# EAGLE design eagle (EAGLE 9.6.2)
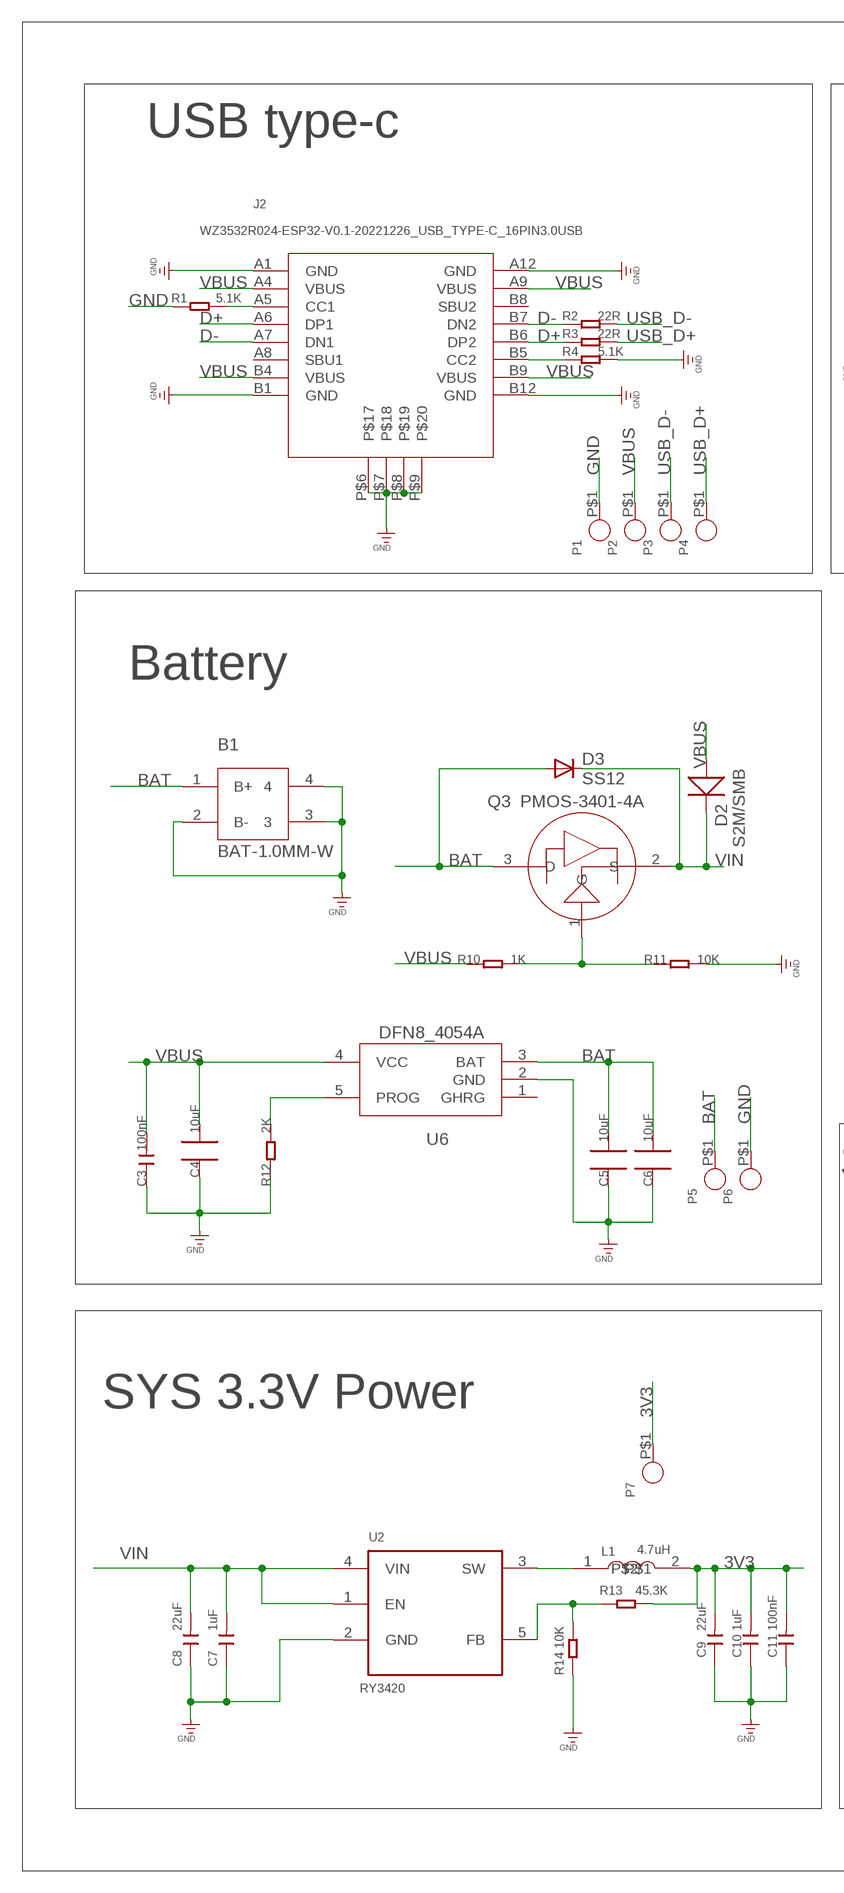
[diagram p0: schematic, sheet 1, part 1 of 2]
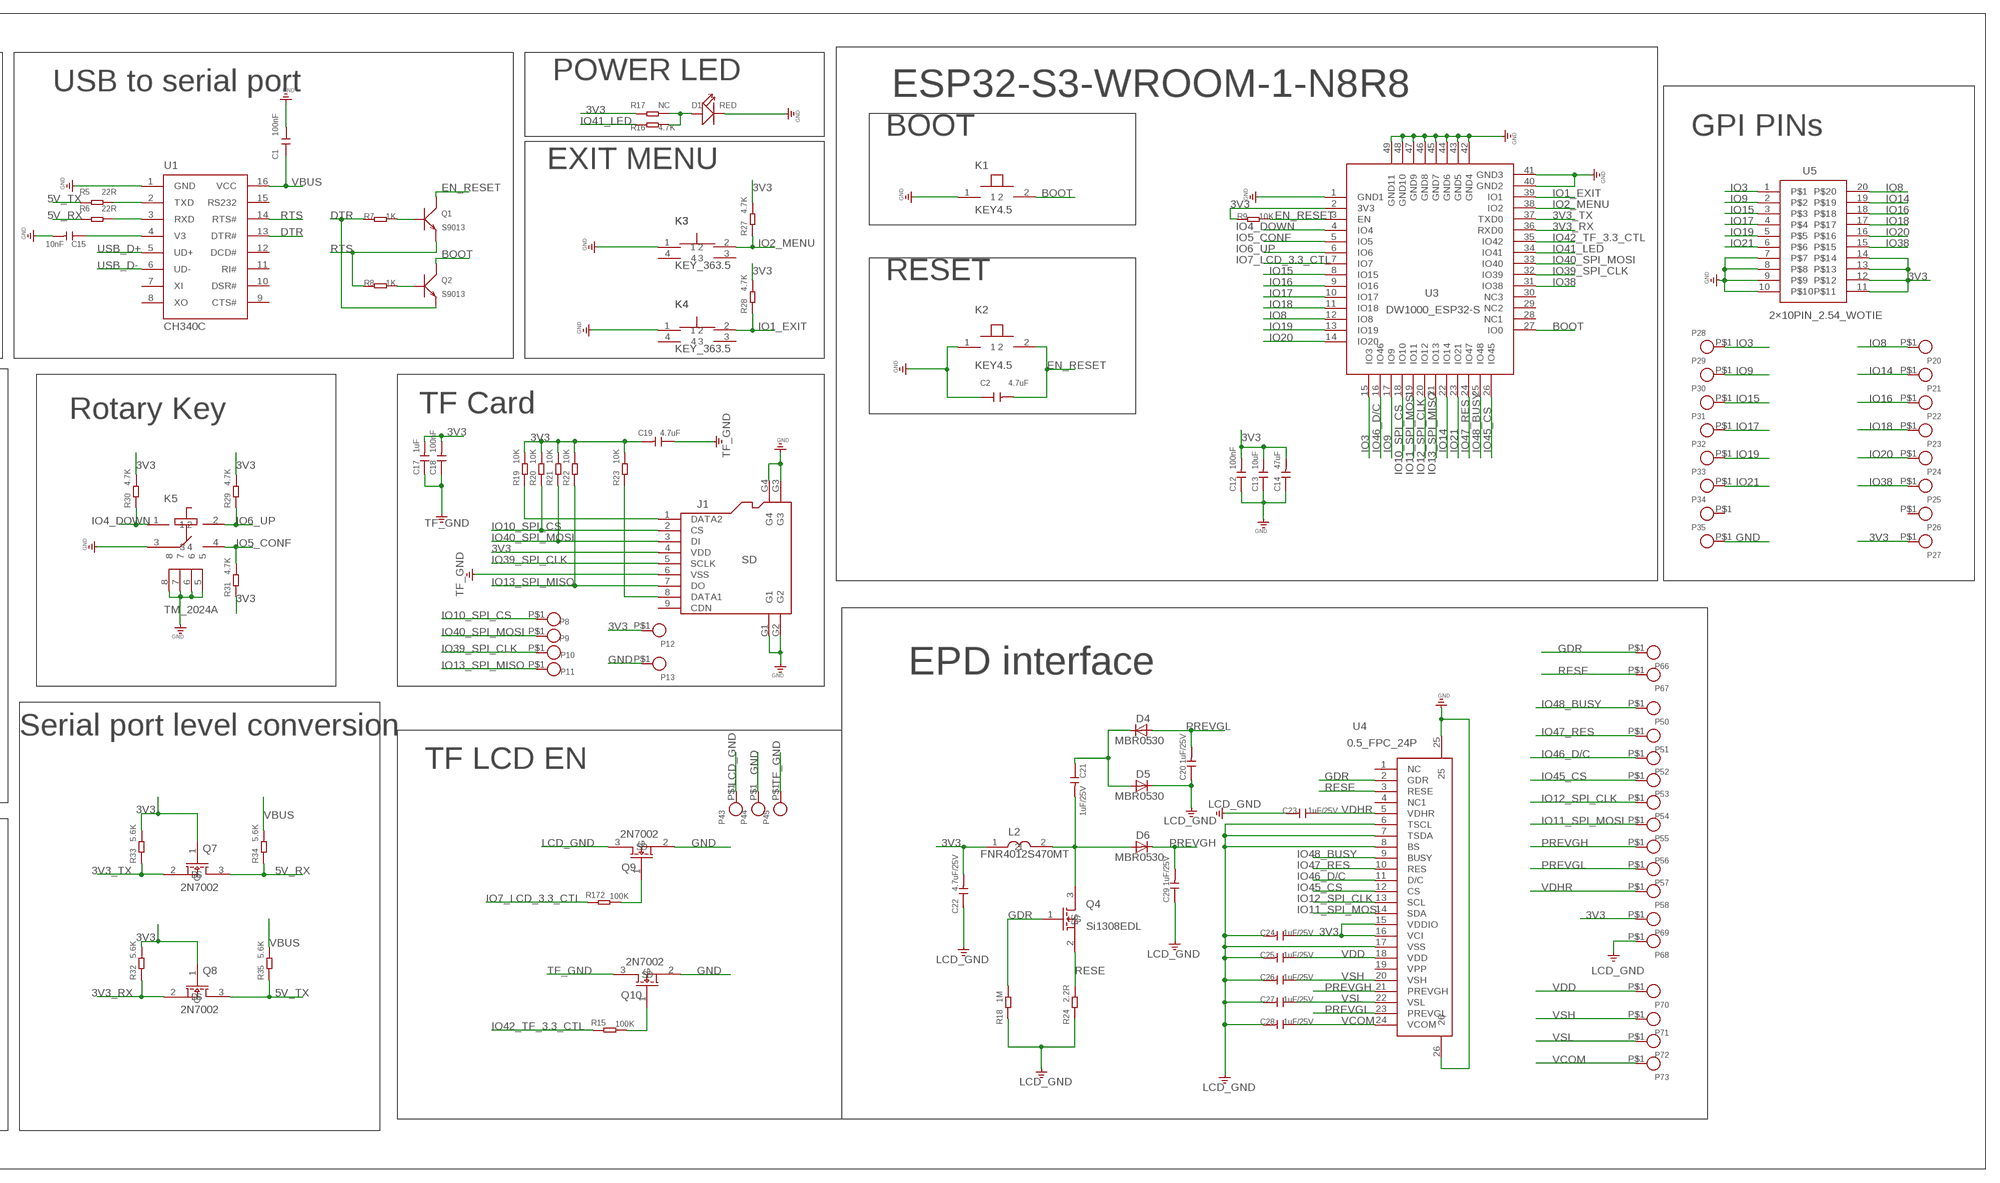
[diagram p1: schematic, sheet 1, part 2 of 2]

## Parts
B1  BAT-1.0MM-W  [SH1.0MM-W]
C1  100nF  C0603  [0603]
C2  4.7uF  A_XBJ_C0603  [A_XBJ_0603]
C3  100nF  A9G_DISCRETE_C-0603  [A9G_DISCRETE_C0603]
C4  10uF  CPT_SMD_C0805_S  [CPT_SMD_0805_S]
C5  10uF  CPT_SMD_C0805_S  [CPT_SMD_0805_S]
C6  10uF  CPT_SMD_C0805_S  [CPT_SMD_0805_S]
C7  1uF  A_XBJ_C0603  [A_XBJ_0603]
C8  22uF  A_XBJ_C0805  [A_XBJ_0805]
C9  22uF  A_XBJ_C0805  [A_XBJ_0805]
C10  1uF  A_XBJ_C0603  [A_XBJ_0603]
C11  100nF  A_XBJ_C0603  [A_XBJ_0603]
C12  100nF  A9G_DISCRETE_C-0603  [A9G_DISCRETE_C0603]
C13  10uF  A9G_DISCRETE_C-0603  [A9G_DISCRETE_C0603]
C14  47uF  A9G_DISCRETE_C-0805  [A9G_DISCRETE_C0805]
C15  10nF  A_XBJ_C0603  [A_XBJ_0603]
C17  1uF  A9G_DISCRETE_C-0603  [A9G_DISCRETE_C0603]
C18  100nF  A9G_DISCRETE_C-0603  [A9G_DISCRETE_C0603]
C19  4.7uF  A9G_DISCRETE_C-0603  [A9G_DISCRETE_C0603]
C20  1uF/25V  A9G_DISCRETE_C-0603  [A9G_DISCRETE_C0603]
C21  1uF/25V  A9G_DISCRETE_C-0603  [A9G_DISCRETE_C0603]
C22  4.7uF/25V  A9G_DISCRETE_C-0603  [A9G_DISCRETE_C0603]
C23  1uF/25V  A9G_DISCRETE_C-0603  [A9G_DISCRETE_C0603]
C24  1uF/25V  A9G_DISCRETE_C-0603  [A9G_DISCRETE_C0603]
C25  1uF/25V  A9G_DISCRETE_C-0603  [A9G_DISCRETE_C0603]
C26  1uF/25V  A9G_DISCRETE_C-0603  [A9G_DISCRETE_C0603]
C27  1uF/25V  A9G_DISCRETE_C-0603  [A9G_DISCRETE_C0603]
C28  1uF/25V  A9G_DISCRETE_C-0603  [A9G_DISCRETE_C0603]
C29  1uF/25V  A9G_DISCRETE_C-0603  [A9G_DISCRETE_C0603]
D1  RED  A_XBJ_DISCRETE_LED0603  [A_XBJ_DISCRETE_LED-0603]
D2  S2M/SMB  DO-214AB_214ABDO-214AB  [DO-214AB_214AB]
D3  SS12  DIODE_DIODE-DO-214AC  [DIODE_DO-214AC]
D4  MBR0530  DIODE_DIODE-SOD123  [DIODE_SOD123]
D5  MBR0530  DIODE_DIODE-SOD123  [DIODE_SOD123]
D6  MBR0530  DIODE_DIODE-SOD123  [DIODE_SOD123]
J1  SD  CONNECTOR_HOLDER-MICROSD-9P  [CONNECTOR_9P-SMD-W/-RING]
J2  WZ3532R024-ESP32-V0.1-20221226_USB_TYPE-C_16PIN3.0USB  [WZ3532R024-ESP32-V0.1-20221226_KEVIN_3.0TYPEC-SMD]
K1  KEY4.5  [KEY-4.5]
K2  KEY4.5  [KEY-4.5]
K3  KEY_363.5  [KEY_3*6*3.5]
K4  KEY_363.5  [KEY_3*6*3.5]
K5  TM_2024A  [TM_2024A]
L1  4.7uH  WZ2432R028-ESP32-V1.2-20231108_L-0530  [WZ2432R028-ESP32-V1.2-20231108_CD54_CD54]
L2  FNR4012S470MT  [FNR4012S470MT]
P1  CROWPI_POW_PADPAD-1.0MM  [CROWPI_POW_PAD-1.0MM]
P2  CROWPI_POW_PADPAD-1.0MM  [CROWPI_POW_PAD-1.0MM]
P3  CROWPI_POW_PADPAD-1.0MM  [CROWPI_POW_PAD-1.0MM]
P4  CROWPI_POW_PADPAD-1.0MM  [CROWPI_POW_PAD-1.0MM]
P5  CROWPI_POW_PADPAD-1.0MM  [CROWPI_POW_PAD-1.0MM]
P6  CROWPI_POW_PADPAD-1.0MM  [CROWPI_POW_PAD-1.0MM]
P7  CROWPI_POW_PADPAD-1.0MM  [CROWPI_POW_PAD-1.0MM]
P8  CROWPI_POW_PADPAD-1.0MM  [CROWPI_POW_PAD-1.0MM]
P9  CROWPI_POW_PADPAD-1.0MM  [CROWPI_POW_PAD-1.0MM]
P10  CROWPI_POW_PADPAD-1.0MM  [CROWPI_POW_PAD-1.0MM]
P11  CROWPI_POW_PADPAD-1.0MM  [CROWPI_POW_PAD-1.0MM]
P12  CROWPI_POW_PADPAD-1.0MM  [CROWPI_POW_PAD-1.0MM]
P13  CROWPI_POW_PADPAD-1.0MM  [CROWPI_POW_PAD-1.0MM]
P20  CROWPI_POW_PADPAD-1.0MM  [CROWPI_POW_PAD-1.0MM]
P21  CROWPI_POW_PADPAD-1.0MM  [CROWPI_POW_PAD-1.0MM]
P22  CROWPI_POW_PADPAD-1.0MM  [CROWPI_POW_PAD-1.0MM]
P23  CROWPI_POW_PADPAD-1.0MM  [CROWPI_POW_PAD-1.0MM]
P24  CROWPI_POW_PADPAD-1.0MM  [CROWPI_POW_PAD-1.0MM]
P25  CROWPI_POW_PADPAD-1.0MM  [CROWPI_POW_PAD-1.0MM]
P26  CROWPI_POW_PADPAD-1.0MM  [CROWPI_POW_PAD-1.0MM]
P27  CROWPI_POW_PADPAD-1.0MM  [CROWPI_POW_PAD-1.0MM]
P28  CROWPI_POW_PADPAD-1.0MM  [CROWPI_POW_PAD-1.0MM]
P29  CROWPI_POW_PADPAD-1.0MM  [CROWPI_POW_PAD-1.0MM]
P30  CROWPI_POW_PADPAD-1.0MM  [CROWPI_POW_PAD-1.0MM]
P31  CROWPI_POW_PADPAD-1.0MM  [CROWPI_POW_PAD-1.0MM]
P32  CROWPI_POW_PADPAD-1.0MM  [CROWPI_POW_PAD-1.0MM]
P33  CROWPI_POW_PADPAD-1.0MM  [CROWPI_POW_PAD-1.0MM]
P34  CROWPI_POW_PADPAD-1.0MM  [CROWPI_POW_PAD-1.0MM]
P35  CROWPI_POW_PADPAD-1.0MM  [CROWPI_POW_PAD-1.0MM]
P43  CROWPI_POW_PADPAD-1.0MM  [CROWPI_POW_PAD-1.0MM]
P44  CROWPI_POW_PADPAD-1.0MM  [CROWPI_POW_PAD-1.0MM]
P45  CROWPI_POW_PADPAD-1.0MM  [CROWPI_POW_PAD-1.0MM]
P50  CROWPI_POW_PADPAD-1.0MM  [CROWPI_POW_PAD-1.0MM]
P51  CROWPI_POW_PADPAD-1.0MM  [CROWPI_POW_PAD-1.0MM]
P52  CROWPI_POW_PADPAD-1.0MM  [CROWPI_POW_PAD-1.0MM]
P53  CROWPI_POW_PADPAD-1.0MM  [CROWPI_POW_PAD-1.0MM]
P54  CROWPI_POW_PADPAD-1.0MM  [CROWPI_POW_PAD-1.0MM]
P55  CROWPI_POW_PADPAD-1.0MM  [CROWPI_POW_PAD-1.0MM]
P56  CROWPI_POW_PADPAD-1.0MM  [CROWPI_POW_PAD-1.0MM]
P57  CROWPI_POW_PADPAD-1.0MM  [CROWPI_POW_PAD-1.0MM]
P58  CROWPI_POW_PADPAD-1.0MM  [CROWPI_POW_PAD-1.0MM]
P66  CROWPI_POW_PADPAD-1.0MM  [CROWPI_POW_PAD-1.0MM]
P67  CROWPI_POW_PADPAD-1.0MM  [CROWPI_POW_PAD-1.0MM]
P68  CROWPI_POW_PADPAD-1.0MM  [CROWPI_POW_PAD-1.0MM]
P69  CROWPI_POW_PADPAD-1.0MM  [CROWPI_POW_PAD-1.0MM]
P70  CROWPI_POW_PADPAD-1.0MM  [CROWPI_POW_PAD-1.0MM]
P71  CROWPI_POW_PADPAD-1.0MM  [CROWPI_POW_PAD-1.0MM]
P72  CROWPI_POW_PADPAD-1.0MM  [CROWPI_POW_PAD-1.0MM]
P73  CROWPI_POW_PADPAD-1.0MM  [CROWPI_POW_PAD-1.0MM]
Q1  S9013  DISCRETE_TRANSISTOR-NPN-SOT23  [DISCRETE_SOT23$1]
Q2  S9013  DISCRETE_TRANSISTOR-NPN-SOT23  [DISCRETE_SOT23$1]
Q3  PMOS-3401-4A  DFN8_P-MOS-SOT23  [DFN8_SOT-23]
Q4  Si1308EDL  HXY2102EI  [SOT-323_W]
Q7  2N7002  NMOS_W  [SOT23-3_W]
Q8  2N7002  NMOS_W  [SOT23-3_W]
Q9  2N7002  NMOS_W  [SOT23-3_W]
Q10  2N7002  NMOS_W  [SOT23-3_W]
R1  5.1K  R0603  [R0603]
R2  22R  R0603  [R0603]
R3  22R  R0603  [R0603]
R4  5.1K  R0603  [R0603]
R5  22R  R0603  [R0603]
R6  22R  R0603  [R0603]
R7  1K  A9G_DISCRETE_R-0603  [A9G_DISCRETE_R0603]
R8  1K  A9G_DISCRETE_R-0603  [A9G_DISCRETE_R0603]
R9  10K  A9G_DISCRETE_R-0603  [A9G_DISCRETE_R0603]
R10  1K  A9G_DISCRETE_R-0603  [A9G_DISCRETE_R0603]
R11  10K  A9G_DISCRETE_R-0603  [A9G_DISCRETE_R0603]
R12  2K  A9G_DISCRETE_R-0603  [A9G_DISCRETE_R0603]
R13  45.3K  A9G_DISCRETE_R-0603  [A9G_DISCRETE_R0603]
R14  10K  A9G_DISCRETE_R-0603  [A9G_DISCRETE_R0603]
R15  100K  R-0603  [R0603]
R16  4.7K  A9G_DISCRETE_R-0603  [A9G_DISCRETE_R0603]
R17  NC  A9G_DISCRETE_R-0603  [A9G_DISCRETE_R0603]
R18  1M  A9G_DISCRETE_R-0603  [A9G_DISCRETE_R0603]
R19  10K  A9G_DISCRETE_R-0603  [A9G_DISCRETE_R0603]
R20  10K  A9G_DISCRETE_R-0603  [A9G_DISCRETE_R0603]
R21  10K  A9G_DISCRETE_R-0603  [A9G_DISCRETE_R0603]
R22  10K  A9G_DISCRETE_R-0603  [A9G_DISCRETE_R0603]
R23  10K  A9G_DISCRETE_R-0603  [A9G_DISCRETE_R0603]
R24  2.2R  A9G_DISCRETE_R-0603  [A9G_DISCRETE_R0603]
R27  4.7K  A9G_DISCRETE_R-0603  [A9G_DISCRETE_R0603]
R28  4.7K  A9G_DISCRETE_R-0603  [A9G_DISCRETE_R0603]
R29  4.7K  A9G_DISCRETE_R-0603  [A9G_DISCRETE_R0603]
R30  4.7K  A9G_DISCRETE_R-0603  [A9G_DISCRETE_R0603]
R31  4.7K  A9G_DISCRETE_R-0603  [A9G_DISCRETE_R0603]
R32  5.6K  DISCRETE_R-0603  [DISCRETE_R0603]
R33  5.6K  DISCRETE_R-0603  [DISCRETE_R0603]
R34  5.6K  DISCRETE_R-0603  [DISCRETE_R0603]
R35  5.6K  DISCRETE_R-0603  [DISCRETE_R0603]
R172  100K  R-0603  [R0603]
U1  CH340C  A_XBJ_CH340G  [A_XBJ_SOP-16]
U2  RY3420  CROWBOT_-V1.0-20220525_A_XBJ_HM3420B  [CROWBOT_-V1.0-20220525_A_XBJ_SOT23-5]
U3  DW1000_ESP32-S  [DW1000_ESP32-S3]
U4  0.5_FPC_24P  [0.5_FPC_24P]
U5  2×10PIN_2.54_WOTIE  [2*10PIN_2.54_WOTIE]
U6  DFN8_4054A  [DFN8_SOP23-5]

## Nets
3V3: C9.2 C10.2 C11.2 C12.2 C13.2 C14.2 C17.2 C18.2 C19.2 C22.2 C24.1 J1.4(VDD) L1.2 L2.1 P7.P$1 P12.P$1 P27.P$1 P69.P$1 Q7.1(G) Q8.1(G) R9.1 R13.2 R17.1 R19.2 R20.2 R21.2 R22.2 R23.2 R27.2 R28.2 R29.2 R30.2 R31.1 R32.2 R33.2 U3.2(3V3) U4.15(VDDIO) U4.16(VCI) U5.11 U5.12 U5.13 U5.14
3V3_RX: Q8.2(S) R32.1 U3.36(RXD0)
3V3_TX: Q7.2(S) R33.1 U3.37(TXD0)
5V_RX: Q7.3(D) R6.1 R34.1
5V_TX: Q8.3(D) R5.1 R35.1
BAT: B1.1(B+) C5.2 C6.2 D3.A P5.P$1 Q3.3(D) U6.3(BAT)
BOOT: K1.2 Q2.3(C) U3.27(IO0)
D+: J2.A6(DP1) J2.B6(DP2) R3.1
D-: J2.A7(DN1) J2.B7(DN2) R2.1
DTR: Q2.2(E) R7.1 U1.13(DTR#)
EN_RESET: C2.2 K2.2 Q1.3(C) R9.2 U3.3(EN)
GDR: P66.P$1 Q4.1(G) R18.2 U4.2(GDR)
GND: B1.2(B-) B1.3 B1.4 C1.2 C2.1 C3.1 C4.1 C5.1 C6.1 C7.1 C8.1 C9.1 C10.1 C11.1 C12.1 C13.1 C14.1 C15.2 D1.- J1.G1 J1.G2 J1.G3 J1.G4 J2.A1(GND) J2.A12(GND) J2.B1(GND) J2.B12(GND) J2.P$6 J2.P$7 J2.P$8 J2.P$9 K1.1 K2.1 K3.1 K4.1 K5.3 K5.5 K5.6 K5.7 K5.8 P1.P$1 P6.P$1 P13.P$1 P35.P$1 P44.P$1 Q9.2(S) Q10.2(S) R1.1 R4.2 R11.2 R12.1 R14.1 U1.1(GND) U2.2(GND) U3.1(GND1) U3.40(GND2) U3.41(GND3) U3.42(GND4) U3.43(GND5) U3.44(GND6) U3.45(GND7) U3.46(GND8) U3.47(GND9) U3.48(GND10) U3.49(GND11) U4.25 U4.26 U5.7 U5.8 U5.9 U5.10 U6.2(GND)
IO1_EXIT: K4.2 R28.1 U3.39(IO1)
IO2_MENU: K3.2 R27.1 U3.38(IO2)
IO3: P28.P$1 U3.15(IO3) U5.1
IO4_DOWN: K5.1 R30.1 U3.4(IO4)
IO5_CONF: K5.4 R31.2 U3.5(IO5)
IO6_UP: K5.2 R29.1 U3.6(IO6)
IO7_LCD_3.3_CTL: R172.1 U3.7(IO7)
IO8: P20.P$1 U3.12(IO8) U5.20
IO9: P29.P$1 U3.17(IO9) U5.2
IO10_SPI_CS: J1.2(CS) P8.P$1 R20.1 U3.18(IO10)
IO11_SPI_MOSI: P55.P$1 U3.19(IO11) U4.14(SDA)
IO12_SPI_CLK: P54.P$1 U3.20(IO12) U4.13(SCL)
IO13_SPI_MISO: J1.7(DO) P11.P$1 R22.1 U3.21(IO13)
IO14: P21.P$1 U3.22(IO14) U5.19
IO15: P30.P$1 U3.8(IO15) U5.3
IO16: P22.P$1 U3.9(IO16) U5.18
IO17: P31.P$1 U3.10(IO17) U5.4
IO18: P23.P$1 U3.11(IO18) U5.17
IO19: P32.P$1 U3.13(IO19) U5.5
IO20: P24.P$1 U3.14(IO20) U5.16
IO21: P33.P$1 U3.23(IO21) U5.6
IO38: P25.P$1 U3.31(IO38) U5.15
IO39_SPI_CLK: J1.5(SCLK) P10.P$1 U3.32(IO39)
IO40_SPI_MOSI: J1.3(DI) P9.P$1 R21.1 U3.33(IO40)
IO41_LED: R16.1 U3.34(IO41)
IO42_TF_3.3_CTL: R15.1 U3.35(IO42)
IO45_CS: P53.P$1 U3.26(IO45) U4.12(CS)
IO46_D/C: P52.P$1 U3.16(IO46) U4.11(D/C)
IO47_RES: P51.P$1 U3.24(IO47) U4.10(RES)
IO48_BUSY: P50.P$1 U3.25(IO48) U4.9(BUSY)
LCD_GND: C20.1 C22.1 C23.2 C24.2 C25.2 C26.2 C27.2 C28.2 C29.1 D5.C P43.P$1 P68.P$1 Q9.3(D) R18.1 R24.1 U4.6(TSCL) U4.7(TSDA) U4.8(BS) U4.17(VSS) ; supply symbol labelled GND
N$1: Q1.1(B) R7.2
N$2: R5.2 U1.2(TXD)
N$3: R6.2 U1.3(RXD)
N$4: Q2.1(B) R8.2
N$5: J2.A5(CC1) R1.2
N$6: Q3.1(G) R10.2 R11.1
N$7: Q9.1(G) R172.2
N$8: Q10.1(G) R15.2
N$9: R13.1 R14.2 U2.5(FB)
N$10: J1.1(DATA2) R19.1
N$11: L1.1 U2.3(SW)
N$12: J2.B5(CC2) R4.1
N$13: C15.1 U1.4(V3)
N$16: R12.2 U6.5(PROG)
N$20: J1.8(DATA1) R23.1
N$25: D1.+ R16.2 R17.2
N$55: C21.1 D4.C D5.A
N$56: C21.2 D6.A L2.2 Q4.3(D)
PREVGH: C29.2 D6.C P56.P$1 U4.21(PREVGH)
PREVGL: C20.2 D4.A P57.P$1 U4.23(PREVGL)
RESE: P67.P$1 Q4.2(S) R24.2 U4.3(RESE)
RTS: Q1.2(E) R8.1 U1.14(RTS#)
TF_GND: C17.1 C18.1 C19.1 J1.6(VSS) P45.P$1 Q10.3(D) ; supply symbol labelled GND
USB_D+: P4.P$1 R3.2 U1.5(UD+)
USB_D-: P3.P$1 R2.2 U1.6(UD-)
VBUS: C1.1 C3.2 C4.2 D2.1(+) J2.A4(VBUS) J2.A9(VBUS) J2.B4(VBUS) J2.B9(VBUS) P2.P$1 R10.1 R34.2 R35.2 U1.16(VCC) U6.4(VCC)
VCOM: C28.1 P73.P$1 U4.24(VCOM)
VDD: C25.1 P70.P$1 U4.18(VDD)
VDHR: C23.1 P58.P$1 U4.5(VDHR)
VIN: C7.2 C8.2 D2.2(-) D3.C Q3.2(S) U2.1(EN) U2.4(VIN)
VSH: C26.1 P71.P$1 U4.20(VSH)
VSL: C27.1 P72.P$1 U4.22(VSL)
Unconnected: J1.9(CDN) J2.A8(SBU1) J2.B8(SBU2) K3.3 K3.4 K4.3 K4.4 P26.P$1 P34.P$1 U1.7(XI) U1.8(XO) U1.9(CTS#) U1.10(DSR#) U1.11(RI#) U1.12(DCD#) U1.15(RS232) U3.28(NC1) U3.29(NC2) U3.30(NC3) U4.1(NC) U4.4(NC1) U4.19(VPP) U6.1(GHRG)

## Notes on the sheet
- USB type-c | POWER LED
- USB to serial port | ESP32-S3-WROOM-1-N8R8
- BOOT | GPI PINs
- EXIT MENU
- RESET
- Rotary Key | TF Card
- Battery
- EPD interface
- Serial port level conversion
- TF LCD EN
- SYS 3.3V Power

## Library data of the parts
B1 = WGH:BAT-1.0MM-W
C1 = WGH:C0603
C2 C7 C10 C11 C15 = CrowPanel ESP32 Display-4.3-inch-V2.1-20240314:A_XBJ_C0603
C3 C12-C14 C17-C29 = CrowPanel ESP32 Display-4.3-inch-V2.1-20240314:A9G_DISCRETE_C*: Ceramic Capacitors
C4-C6 = CrowPanel ESP32 Display-4.3-inch-V2.1-20240314:CPT_SMD_C0805
C8 C9 = CrowPanel ESP32 Display-4.3-inch-V2.1-20240314:A_XBJ_C0805
D1 = CrowPanel ESP32 Display-4.3-inch-V2.1-20240314:A_XBJ_DISCRETE_LED*
D2 = CrowPanel ESP32 Display-4.3-inch-V2.1-20240314:DO-214AB_214AB: 214AB
D3-D6 = CrowPanel ESP32 Display-4.3-inch-V2.1-20240314:DIODE_DIODE-: DIODE
J1 = CrowPanel ESP32 Display-4.3-inch-V2.1-20240314:CONNECTOR_HOLDER-MICROSD-9P
J2 = CrowPanel ESP32 Display-4.3-inch-V2.1-20240314:WZ3532R024-ESP32-V0.1-20221226_USB_TYPE-C_16PIN
K1 K2 = WGH:KEY4.5
K3 K4 = WGH:KEY_3*6*3.5
K5 = WGH:TM_2024A
L1 = CrowPanel ESP32 Display-4.3-inch-V2.1-20240314:WZ2432R028-ESP32-V1.2-20231108_L-0530
L2 = WGH:FNR4012S470MT
P1-P13 P20-P35 P43-P45 P50-P58 P66-P73 = ESP32 Terminal - 3.5 Inch_2.0:CROWPI_POW_PAD*
Q1 Q2 = CrowPanel ESP32 Display-4.3-inch-V2.1-20240314:DISCRETE_TRANSISTOR-NPN*: NPN audion
Q3 = CrowPanel ESP32 Display-4.3-inch-V2.1-20240314:DFN8_P-MOS-SOT23
Q4 = WGH:HXY2102EI
Q7-Q10 = WGH:NMOS_W
R1-R6 = WGH:R0603
R7-R14 R16-R24 R27-R31 = CrowPanel ESP32 Display-4.3-inch-V2.1-20240314:A9G_DISCRETE_R*
R15 R172 = discrete:R*
R32-R35 = CrowPanel ESP32 Display-4.3-inch-V2.1-20240314:DISCRETE_R*
U1 = CrowPanel ESP32 Display-4.3-inch-V2.1-20240314:A_XBJ_CH340G
U2 = CrowPanel ESP32 Display-4.3-inch-V2.1-20240314:CROWBOT_-V1.0-20220525_A_XBJ_HM3420B
U3 = CrowPanel ESP32 Display-4.3-inch-V2.1-20240314:DW1000_ESP32-S
U4 = ESP32 Terminal - 3.5 Inch_2.0:0.5_FPC_24P
U5 = WGH:2×10PIN_2.54_WOTIE
U6 = CrowPanel ESP32 Display-4.3-inch-V2.1-20240314:DFN8_4054A

## Net classes
0 default: width 0.254 mm, drill 0.305 mm, clearance 0.152 mm

## Board
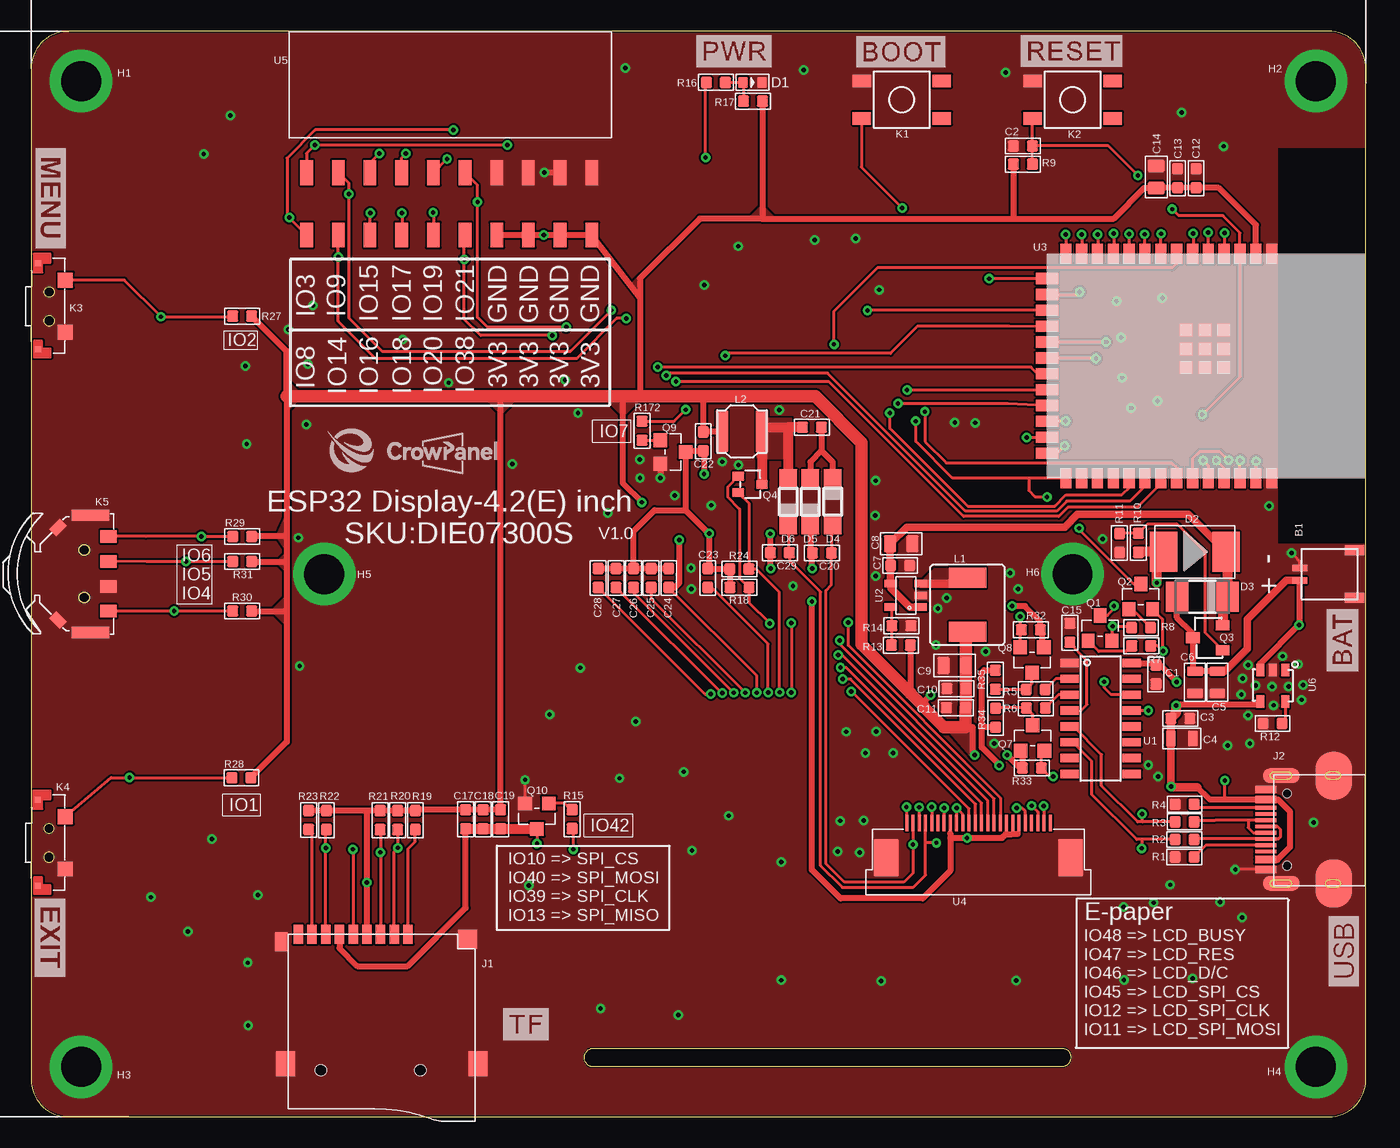
[diagram p2: board, top side]
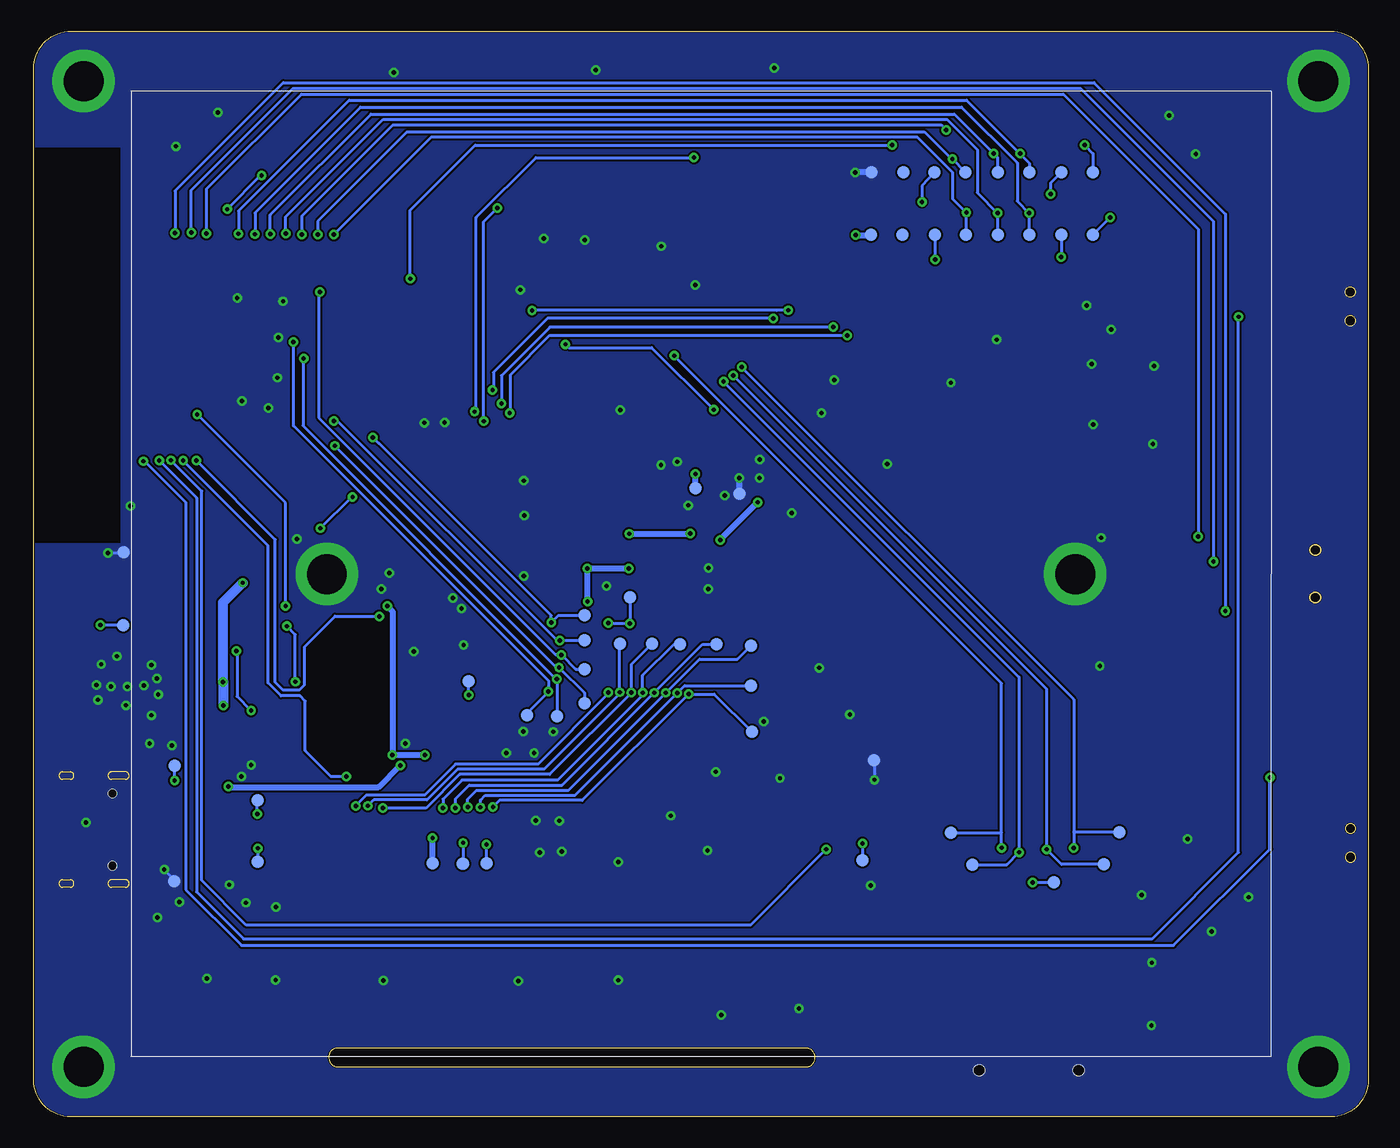
[diagram p3: board, bottom side, seen from below]

Size 107 x 87 mm. Coordinates in mm from the lower left corner, seen from the top.
Outline: 0,84.01 0,2.98 arc90 2.98,0 104.03,0 arc90 107,2.97 107,84.01 arc90 104.01,87 2.99,87 arc90 0,84.01
Outline: 83.34,4.81 83.34,4.75 arc-90 82.59,3.99 45.1,3.99 arc-90 44.35,4.71 44.35,4.76 arc-90 45.1,5.5 82.61,5.5 arc-90 83.34,4.81
Copper layers (1*16): Top 0.035mm / dielectric 1.5mm / Bottom 0.035mm
Design rules "default *": minimum track width 6mil, minimum drill 0.35mm, track to track 6mil, track to pad 6mil, pad to pad 6mil, via to via 6mil, smd to smd 6mil, copper to edge 2mil, drill to drill 6mil, minimum pad ring 10mil, minimum via ring 8mil, stop-mask expansion 4mil, vias tented up to drill 100mil, thermal gap 0mil

### Footprints (pad centres in the part's own frame; a part is rotated, then mirrored left to right if it is on the bottom)
SH1.0MM-W = smd 0.5 x 1.2: 1 -0.5,2.4; 2 0.5,2.4 | smd 0.8 x 1.6: 3 -1.9,-2; 4 1.9,-2
0603 = smd 0.889 x 0.889: 1 -0.762,0; 2 0.762,0
A_XBJ_0603 = smd 0.889 x 0.889: 1 -0.762,0; 2 0.762,0
A9G_DISCRETE_C0603 = smd 0.889 x 0.889: 1 -0.762,0; 2 0.762,0
CPT_SMD_0805_S = smd 0.762 x 1.27: 1 -0.889,0; 2 0.889,0
A_XBJ_0805 = smd 1.016 x 1.397: 1 -0.889,0; 2 0.889,0
A9G_DISCRETE_C0805 = smd 1.016 x 1.397: 1 -0.889,0; 2 0.889,0
A_XBJ_DISCRETE_LED-0603 = smd 0.762 x 0.889: + -0.762,0; - 0.762,0
DO-214AB_214AB = smd 2.2 x 3.2: 1 -2.5,0; 2 2.5,0
DIODE_DO-214AC = smd 1.8 x 2.4: A 2.025,0; C -2.025,0
DIODE_SOD123 = smd 1.4 x 1.4: A 1.9,0; C -1.9,0
CONNECTOR_9P-SMD-W/-RING = smd 1.524 x 0.762: 1 0,4.4; 2 0,3.3; 3 0,2.2; 4 0,1.1; 5 0,0; 6 0,-1.1; 7 0,-2.2; 8 0,-3.3; 9 0,-4.4 | smd 1.524 x 1.016: G1 0.6,-5.746 | smd 2.032 x 1.524: G2 10.373,-5.4; G3 10.373,10 | smd 1.524 x 1.524: G4 0.392,9.181 | hole 0.889: 10.9,-2.6; 10.9,5.4
WZ3532R024-ESP32-V0.1-20221226_KEVIN_3.0TYPEC-SMD = smd 0.3 x 1.7: A1 -3.35,0.5; A4 -2.55,0.5; A5 -1.25,0.5; A6 -0.25,0.5; A7 0.25,0.5; A8 1.25,0.5; A9 2.55,0.5; A12 3.35,0.5; B1 3.05,0.5; B4 2.25,0.5; B5 1.75,0.5; B6 0.75,0.5; B7 -0.75,0.5; B8 -1.75,0.5; B9 -2.25,0.5; B12 -3.05,0.5 | smd 1.143 x 2.921: P$6 -4.318,-0.762; P$7 4.318,-0.762 | smd 3.81 x 2.921: P$8 -4.318,-4.953; P$9 4.318,-4.953 | hole 0.68: -2.89,-1.22; 2.89,-1.22
KEY-4.5 = smd 1.5 x 1: 1 -3.2,1.5; 2 -3.2,-1.5; 3 3.2,-1.5; 4 3.2,1.5
KEY_3*6*3.5 = smd 1.2 x 1.2: 1 -2.1,-2.6; 2 2.1,-2.6 | smd 0.5 x 0.5: 3 3.45,-0.4; 4 -3.45,-0.4
TM_2024A = smd 1 x 1.3: 1 -3,0.65; 2 3,0.65; 3 -1,0.65; 4 1,0.65 | smd 0.9 x 3: 5 -4.7,2.1; 6 4.7,2.1 | smd 1.2 x 0.8 rotated 45: 7 -3.7,4.7 | smd 1.2 x 0.8 rotated 135: 8 3.7,4.7
WZ2432R028-ESP32-V1.2-20231108_CD54_CD54 = smd 3 x 1.6: 1 0,2.159; 2 0,-2.159
FNR4012S470MT = smd 0.95 x 3.3: 1 -1.6,0; 2 1.6,0
CROWPI_POW_PAD-1.0MM = smd 1 x 1: P$1 0,0
DISCRETE_SOT23$1 = smd 1.016 x 1.143: 1 -0.95,-1.016; 2 0.95,-1.016; 3 0,1.016
DFN8_SOT-23 = smd 1.1 x 0.8: 1 1.2,-1; 2 1.2,1 | smd 1.1 x 0.9: 3 -1.2,0
SOT-323_W = smd 0.7 x 0.9: 1 -0.65,-0.95; 2 0.65,-0.95; 3 0,0.95
SOT23-3_W = smd 1.1 x 1.1: 1 -0.95,-1.016; 2 0.95,-1.016; 3 0,1.016
R0603 = smd 0.889 x 0.889: 1 -0.762,0; 2 0.762,0
A9G_DISCRETE_R0603 = smd 0.889 x 0.889: 1 -0.762,0; 2 0.762,0
DISCRETE_R0603 = smd 0.889 x 0.889: 1 -0.762,0; 2 0.762,0
A_XBJ_SOP-16 = smd 0.66 x 1.5: 1 -4.445,-2.475; 2 -3.175,-2.475; 3 -1.905,-2.475; 4 -0.635,-2.475; 5 0.635,-2.475; 6 1.905,-2.475; 7 3.175,-2.475; 8 4.445,-2.475; 9 4.445,2.475; 10 3.175,2.475; 11 1.905,2.475; 12 0.635,2.475; 13 -0.635,2.475; 14 -1.905,2.475; 15 -3.175,2.475; 16 -4.445,2.475
CROWBOT_-V1.0-20220525_A_XBJ_SOT23-5 = smd 0.6 x 1: 1 -0.95,-1.2; 2 0,-1.2; 3 0.95,-1.2; 4 0.95,1.2; 5 -0.95,1.2
DW1000_ESP32-S3 = smd 1.6 x 0.9: 1 0,18.01; 2 0,16.74; 3 0,15.47; 4 0,14.2; 5 0,12.93; 6 0,11.66; 7 0,10.39; 8 0,9.12; 9 0,7.85; 10 0,6.58; 11 0,5.31; 12 0,4.04; 13 0,2.77; 14 0,1.5; 27 18,1.5; 28 18,2.77; 29 18,4.04; 30 18,5.31; 31 18,6.58; 32 18,7.85; 33 18,9.12; 34 18,10.39; 35 18,11.66; 36 18,12.93; 37 18,14.2; 38 18,15.47; 39 18,16.74; 40 18,18.01 | smd 0.9 x 1.8: 15 2,0; 16 3.28,0; 17 4.55,0; 18 5.82,0; 19 7.09,0; 20 8.36,0; 21 9.63,0; 22 10.9,0; 23 12.17,0; 24 13.44,0; 25 14.71,0; 26 16,0 | smd 1 x 1: 41 7.64,11.16; 42 9.14,11.16; 43 6.14,11.16; 44 6.14,14.16; 45 7.64,12.66; 46 9.14,12.66; 47 7.64,14.16; 48 9.14,14.16; 49 6.14,12.66
0.5_FPC_24P = smd 1.3 x 0.3: 1 -2.54,5.75; 2 -2.54,5.25; 3 -2.54,4.75; 4 -2.54,4.25; 5 -2.54,3.75; 6 -2.54,3.25; 7 -2.54,2.75; 8 -2.54,2.25; 9 -2.54,1.75; 10 -2.54,1.25; 11 -2.54,0.75; 12 -2.54,0.25; 13 -2.54,-0.25; 14 -2.54,-0.75; 15 -2.54,-1.25; 16 -2.54,-1.75; 17 -2.54,-2.25; 18 -2.54,-2.75; 19 -2.54,-3.25; 20 -2.54,-3.75; 21 -2.54,-4.25; 22 -2.54,-4.75; 23 -2.54,-5.25; 24 -2.54,-5.75 | smd 3 x 2: 25 0.27,-7.4; 26 0.27,7.4
2*10PIN_2.54_WOTIE = smd 1.02 x 2: 1 1.4,-7; 2 3.94,-7; 3 6.48,-7; 4 9.02,-7; 5 11.56,-7; 6 14.1,-7; 7 16.64,-7; 8 19.18,-7; 9 21.72,-7; 10 24.26,-7; 11 24.26,-12; 12 21.72,-12; 13 19.18,-12; 14 16.64,-12; 15 14.1,-12; 16 11.56,-12; 17 9.02,-12; 18 6.48,-12; 19 3.94,-12; 20 1.4,-12
DFN8_SOP23-5 = smd 1 x 0.635: 1 -1.27,1; 2 -1.27,0; 3 -1.27,-1; 4 1.27,-1; 5 1.27,1

### Placement (x,y rotation side)
B1  104.09,43.48 90 top
C1  90.17,35.44 270 top
C2  79.5,77.8 0 top
C3  92.13,31.91 180 top
C4  92.24,30.31 180 top
C5  95.09,34.82 90 top
C6  93.29,34.82 90 top
C7  69.66,44.17 180 top
C8  69.75,45.92 180 top
C9  74.04,36.16 0 top
C10  74.17,34.31 0 top
C11  74.14,32.77 0 top
C12  93.39,75.21 270 top
C13  91.91,75.21 270 top
C14  90.19,75.31 270 top
C15  83.27,38.78 90 top
C17  34.83,23.84 90 top
C18  36.23,23.84 90 top
C19  37.63,23.84 90 top
C20  63.39,45.18 0 top
C21  62.59,55.26 180 top
C22  53.88,54.12 90 top
C23  54.24,43.17 90 top
C24  51.11,43.17 90 top
C25  49.7,43.17 90 top
C26  48.29,43.17 90 top
C27  46.88,43.17 90 top
C28  45.45,43.17 90 top
C29  60.02,45.19 0 top
D1  57.83,82.89 0 top
D2  93.28,45.26 0 top
D3  93.88,41.67 180 top
D4  64.27,49.29 270 top
D5  62.46,49.28 90 top
D6  60.7,49.28 90 top
J1  25.81,14.62 270 top
J2  99.47,23.01 90 top
K1  69.79,81.51 0 top
K2  83.49,81.51 0 top
K3  KEY_36*3.5  [KEY_3*6*3.5]  0.14,64.95 90 top
K4  KEY_36*3.5  [KEY_3*6*3.5]  0.13,21.95 90 top
K5  6.85,43.51 90 top
L1  75.06,41.02 0 top
L2  56.98,54.93 0 top
P1  95.72,18.87 0 bottom
P2  95.7,28.12 0 bottom
P3  89.04,20.44 0 bottom
P4  89.05,25.35 0 bottom
P5  99.8,39.4 0 bottom
P6  99.79,45.22 0 bottom
P7  72.14,34.89 0 bottom
P8  33.45,22.76 0 bottom
P9  31.73,20.21 0 bottom
P10  21.19,20.23 0 bottom
P11  19.95,22.78 0 bottom
P12  25.19,18.78 0 bottom
P13  39.62,28.56 0 bottom
P20  22.08,70.69 0 bottom
P21  24.61,70.69 0 bottom
P22  27.17,70.69 0 bottom
P23  29.69,70.69 0 bottom
P24  32.26,70.69 0 bottom
P25  34.75,70.69 0 bottom
P26  37.34,70.69 0 bottom
P27  39.86,70.69 0 bottom
P28  22.07,75.68 0 bottom
P29  24.62,75.68 0 bottom
P30  27.15,75.68 0 bottom
P31  29.71,75.68 0 bottom
P32  32.28,75.68 0 bottom
P33  34.79,75.68 0 bottom
P34  37.26,75.68 0 bottom
P35  39.85,75.68 0 bottom
P43  53.92,50.36 0 bottom
P44  50.43,49.94 0 bottom
P45  40.55,20.54 0 bottom
P50  62.85,40.18 0 bottom
P51  62.85,38.17 0 bottom
P52  62.84,35.86 0 bottom
P53  62.85,33.15 0 bottom
P54  65.05,32.09 0 bottom
P55  67.46,32.16 0 bottom
P56  72.59,20.29 0 bottom
P57  70.69,20.32 0 bottom
P58  57.42,37.91 0 bottom
P66  59.2,41.63 0 bottom
P67  59.97,37.92 0 bottom
P68  75.02,20.3 0 bottom
P69  55.16,37.85 0 bottom
P70  52.25,37.85 0 bottom
P71  49.5,37.76 0 bottom
P72  49.48,34.55 0 bottom
P73  49.42,30.85 0 bottom
Q1  85.69,39.16 0 top
Q2  88.96,41.68 0 top
Q3  94.32,38.39 0 top
Q4  57.63,50.67 270 top
Q7  80.28,30.35 0 top
Q8  80.24,36.6 180 top
Q9  51.45,53.27 270 top
Q10  40.54,24.08 180 top
R1  92.46,20.81 0 top
R2  92.46,22.22 180 top
R3  92.47,23.63 180 top
R4  92.47,25.04 180 top
R5  80.52,34.23 0 top
R6  80.54,32.76 0 top
R7  88.99,37.73 180 top
R8  88.98,39.2 0 top
R9  79.51,76.34 0 top
R10  88.76,45.99 90 top
R11  87.25,45.98 270 top
R12  99.52,31.52 0 top
R13  69.73,37.79 0 top
R14  69.76,39.34 180 top
R15  43.37,23.85 90 top
R16  54.89,82.89 0 top
R17  57.87,81.39 180 top
R18  56.78,42.42 0 top
R19  30.79,23.77 90 top
R20  29.38,23.77 90 top
R21  27.97,23.77 90 top
R22  23.66,23.77 90 top
R23  22.23,23.78 90 top
R24  56.77,43.89 0 top
R27  16.91,64.16 0 top
R28  16.85,27.17 0 top
R29  16.92,46.5 0 top
R30  16.92,40.53 0 top
R31  16.92,44.49 180 top
R32  80.14,39.03 0 top
R33  80.22,27.95 180 top
R34  77.32,31.97 270 top
R35  77.3,35.02 90 top
R172  48.97,54.97 270 top
U1  85.74,31.92 270 top
U2  70.12,41.78 90 top
U3  81.44,69.17 270 top
U4  75.94,21.01 270 top
U5  20.68,82.66 0 top
U6  99.53,34.54 270 top
U$30  [LOGO-1]  23.38,51.04 0 top
U$42  [LOGO-MIN]  29.53,51.64 0 top

### Tracks (layer width: path | path; a pad name or v marks a point on that pad's centre or on a via)
3V3  (via drill 0.35)
  Top 0.254: v58.17,33.98 58.17,35.36 C24.1 | U4.16 v74.19,24.74 74.69,24.23 U4.15 | 71.58,32.82 71.58,32.85 | 78.75,71.99 78.74,71.99
  Top 0.5: Q8.1 81.02,37.79 81.02,38.92 R32.2 80.91,39.69 79.67,40.92 v78.65,40.92 | Q7.1 79.46,29.21 R33.2 79.28,27.95 v78.23,29 | L1.2 74.93,38.73 | C10.2 | 74.94,32.8 C11.2 | L2.1 53.93,54.93 C22.2 53.88,57.72 | 74.91,31.23 75.48,31.23 75.48,28.98 v75.63,28.98 | 20.48,46.56 20.48,57.74 20.48,61.36 R27.2 | 20.48,46.56 20.48,44.45 | 20.48,44.45 20.48,40.33 | 20.48,40.33 20.48,30.04 R28.2 | R30.2 20.29,40.53 20.48,40.33 | R31.1 20.44,44.49 20.48,44.45 | R29.2 17.75,46.56 20.48,46.56 | 37.58,57.74 37.6,57.72 37.63,57.69 C19.2 C18.2 C17.2 30.86,24.61 R19.2 R20.2 R21.2 26.94,24.54 | 26.94,24.54 R22.2 R23.2 | J1.4 v26.91,18.77 26.91,24.51 26.94,24.54 | U3.2 98.18,71.47 95.21,74.45 C12.2 C13.2 90.22,74.45 C14.2 89.22,74.43 86.78,71.99 78.74,71.99 58.54,71.99 | 58.54,71.99 53.6,71.99 48.81,67.19 48.81,65.69 | 58.54,71.99 58.64,72.08 R17.1 | 48.81,65.69 48.81,57.72 | 48.81,65.69 48.78,65.66 U5.11 U5.12 v41.08,70.66 U5.13 U5.14 | C24.1 51.58,42.41 51.96,42.79 v51.96,46.21 | R13.2 70.5,33.93 | v48.95,49.24 47.42,50.77 47.42,57.72 | R9.1 78.75,71.99 | 71.58,32.82 71.58,33.26 v72.12,33.8
  Top 1: 74.93,38.73 C9.2 C10.2 | C10.2 74.94,32.8 | C11.2 74.91,31.23 73.16,31.23 71.58,32.82 | 37.6,57.72 47.42,57.72 48.81,57.72 53.88,57.72 62.86,57.72 66.55,54.03 66.55,37.87 70.5,33.93 71.58,32.85 | 37.58,57.74 20.48,57.74
  Bottom 0.254: v74.19,24.74 74.19,25.46 72.67,26.97 64.98,26.97 58.17,33.79 v58.17,33.98 58.17,35.37 55.68,37.85 P69.P$1 | v72.12,33.8 72.12,34.87 P7.P$1 | v26.91,18.77 v26.9,18.78 P12.P$1
  Bottom 0.5: v78.65,40.92 78.23,40.5 v78.23,29 78.21,29.03 75.68,29.03 v75.63,28.98 | v51.96,46.21 51.96,46.23 v48.95,49.24 | v41.08,70.66 39.91,70.66 P27.P$1
  pour Top: 20.39,41.63 19.31,40.55 19.31,40.53 20.46,39.38 20.46,41.55 20.4,41.61
  pour Top: 20.49,48.35 20.42,48.18 19.71,46.57 20.42,45.48 20.49,44.98
  pour Top: 20.41,45.11 19.73,44.43 20.47,43.68 20.47,45.1 20.46,45.11
  pour Top: 45.79,57.84 47.46,56.17 49.03,57.74
  pour Top: 49.85,57.77 49.81,57.81 47.76,57.81
  pour Top: 48.73,66.41 48.75,65.88 48.75,66.39
  pour Top: 58.57,73.01 57.58,72.02 59.58,72.02 58.59,73.01
  pour Top: 20.49,58.69 20.5,56.74 20.5,58.68
  pour Top: 20.46,59.04 21.73,57.77 20.45,56.49 20.45,59.04
  pour Top: 36.3,57.72 37.68,56.35 39.04,57.71 39.03,57.72
  pour Top: 47.87,57.76 49.66,57.75 47.85,57.75
  pour Top: 48.93,67.51 47.97,66.55 48.92,65.6 48.93,65.47
  pour Top: 73.48,31.25 75.48,31.25 75.48,28.98
3V3_RX  (via drill 0.35)
  Top 0.254: Q8.2 79.29,38.95 R32.1 79.29,39.12 v79.29,40.1 | v93.94,52.6 94.37,52.17 U3.36
  Bottom 0.254: v93.94,52.6 93.94,52.57 87.62,46.25 87.62,34.8 87.01,34.19 85.7,34.19 85.31,34.58 85.31,37.64 82.83,40.12 79.32,40.12 79.32,40.13 v79.29,40.1
3V3_TX  (via drill 0.35)
  Top 0.254: v81.92,27.26 81.68,27.26 R33.1 80.99,29.09 Q7.2 | U3.37 95.64,51.97 v95.01,52.6
  Bottom 0.254: v95.01,52.6 95.01,52.58 88.21,45.78 88.21,34.78 87.16,33.73 85.64,33.73 85.22,33.31 85.22,29.33 83.15,27.26 v81.92,27.26
5V_RX
  Top 0.254: Q7.3 80.28,32.26 R6.1 77.35,32.76 R34.1
5V_TX
  Top 0.254: Q8.3 80.24,34.72 R5.1 77.33,34.23 R35.1
BAT  (via drill 0.35)
  Top 0.5: U6.3 98.53,36.31 v101.64,39.42 101.69,39.48 B1.1 | C5.2 C6.2 93.12,35.88 Q3.3 93.12,38.74 91.86,40.01 D3.A
  Top 0.6: B1.1 100.62,42.98 97.49,39.85 97.49,37.49 95.71,35.71 C5.2
  Bottom 0.254: v101.64,39.42 99.82,39.42 P5.P$1
BOOT  (via drill 0.35)
  Top 0.254: v70.91,55.74 70.91,54.13 73.87,51.17 U3.27 79.97,51.14 79.97,50.19 80.5,49.66 v81.43,49.66 | v69.83,72.82 66.55,76.1 66.55,79.97 K1.2 | v84.02,47.16 84.02,47.05 88.38,42.7 Q2.3
  Bottom 0.254: v70.91,55.74 70.91,71.74 v69.84,72.82 v69.83,72.82 | v84.02,47.16 81.52,49.66 v81.43,49.66
D+
  Top 0.254: J2.B6 97.57,23.77 | 97.57,23.77 96.81,23.77 94.93,23.77 93.38,23.77 R3.1 | 97.57,23.77 97.57,23.16 97.97,22.76 J2.A6
D-
  Top 0.254: R2.1 93.27,22.26 J2.B7 99.98,22.26 100.17,22.45 100.17,23 99.91,23.26 J2.A7
DTR  (via drill 0.35)
  Top 0.254: v89.56,32.55 U1.13 | R7.1 90.3,37.73 90.71,37.32 v90.75,37.32 90.7,37.37 90.7,39.88 Q2.2
  Bottom 0.254: v89.56,32.55 90.7,33.69 90.7,37.28 v90.75,37.32
EN_RESET  (via drill 0.35)
  Top 0.254: v93.89,56.27 96.9,59.28 U3.3 96.91,70.84 95.54,72.21 92,72.21 v91.48,72.73 | v88.72,75.44 86.36,77.8 C2.2 | Q1.3 86.28,40.18 86.8,40.69 v86.8,40.93 | C2.2 80.27,79.99 K2.2 | R9.2 80.28,77.79 C2.2
  Bottom 0.254: v91.48,72.73 v91.48,72.74 88.78,75.44 v88.72,75.44 | v93.89,56.27 93.82,56.2 93.82,56.22 86.8,49.2 v86.8,40.93
GDR  (via drill 0.35)
  Top 0.254: v59.22,39.53 57.55,41.21 R18.2 56.81,43.16 56.81,48.7 55.84,49.66 55.84,50.49 Q4.1 | v60.94,33.99 v60.95,33.99 60.95,39.55 v60.93,39.57 | v81.18,24.9 v81.19,24.89 U4.2
  Bottom 0.254: v60.93,39.57 59.25,39.57 | 59.25,39.57 v59.22,39.53 | v81.18,24.9 80.29,25.8 75.64,25.8 73.18,28.26 66.57,28.26 60.94,33.89 v60.94,33.99 | P66.P$1 59.2,39.62 59.25,39.57
GND  (via drill 0.35, 3.2 pad 5)
  Top 0.254: J2.B1 J2.A12 | v96.53,19.81 96.56,19.84 98.79,19.84 J2.A1 J2.B12 | v101.04,45.19 101.4,44.84 101.69,44.49 B1.2 | Q10.2 v39.59,27
  Top 0.5: U5.9 v41.14,75.66 | Q9.2 v50.44,51.19 v50.43,51.18
  Bottom 0.254: v96.53,19.81 95.72,19 P1.P$1 | v101.04,45.19 99.82,45.19 P6.P$1 | P13.P$1 39.59,28.53 v39.59,27
  Bottom 0.5: P44.P$1 v50.43,51.18 | P35.P$1 41.12,75.68 v41.14,75.66
  other vias: 4,83 103,83 83.49,43.49 23.49,43.49 4,4 103,4 48.81,51.2 46.22,48.37 48.46,31.66 47.17,27.13 97.7,29.91 95.31,17.2 97.08,15.97 95.9,29.76 60.13,20.42 64.66,21.24 53.96,66.64 56.69,69.76 62.8,70.26 66.1,70.39 67.99,66.27 61.07,42.52 77.2,29.91 55.41,52.49 56.7,52.23 59.97,56.65 54.52,49 76.53,37.28 72.53,37.82 72.69,40.73 73.39,41.56 78.47,43.58 79.12,42.29 15.97,80.24 13.83,77.16 17.18,60.16 20.62,63.1 17.27,53.91 22.06,55.48 22.19,60.31 21.43,46.4 21.52,36.12 14.48,22.25 9.59,17.59 12.55,14.85 18.16,17.77 17.35,12.34 17.39,7.31 39.9,18.53 45.64,8.66 51.87,8.16 41.56,32.23 44.02,35.98 38.58,52.3 90.34,27.27 60.13,10.94 68.15,10.87 78.97,10.92 87.59,16.81 87.6,10.96 91.32,18.59 93.11,11.08 102.8,23.58 89.56,28.19 99.24,48.94 43.84,56.39 42.81,59.05 33.46,58.82 22.59,65.02 47.64,84.06 61.94,83.89 78.13,83.67 92.23,80.48 95.58,77.77 29.79,62.27 87,65.35 87.37,62.46 87.46,59.22 88.19,56.81 90.3,57.36 90.68,65.62 65.35,30.85 67.74,30.86 66.88,29.16 69.09,29.14 52.98,21.33 64.85,23.72 66.74,23.74 66.43,21.19 52.31,27.64 85.89,46.29 89.97,17.15 55.92,24.12 48.8,52.67 51.58,49.78 74.05,55.63 75.67,55.61 67.7,50.97 67.66,48.19 67.7,43.32 52.9,43.98 52.92,42.3 99.61,32.97 97.55,36.21 97.12,35.11 97.01,33.84 97.56,32.17 98.17,34.57 99.48,34.46 100.81,34.49 100.32,36.9 101.58,36.26 101.97,34.6 101.83,33.41
  pour Top (rank 2): -6.75,88.42 -6.75,-2.41 112,-2.41 112,45.89 99.95,45.89 99.95,77.69 109.13,77.69 109.13,88.4 -6.73,88.4
  pour Bottom: -6.86,88.57 -6.86,-2.35 111.56,-2.35 111.56,45.95 99.96,45.95 99.96,77.69 99.95,77.69 109.21,77.69 109.21,88.58 -6.87,88.58
IO1_EXIT  (via drill 0.35)
  Top 0.254: K4.2 6.42,27.18 v7.89,27.18 16.08,27.18 R28.1 | U3.39 v98.19,52.53
  Bottom 0.254: v7.89,27.18 7.89,21.44 15.61,13.72 90.33,13.72 94.8,18.19 94.8,49.24 98.1,52.53 v98.19,52.53
IO2_MENU  (via drill 0.35)
  Top 0.254: K3.2 7.46,67.05 v10.4,64.11 16.1,64.11 R27.1 | v96.93,52.59 96.91,52.61 U3.38
  Bottom 0.254: v10.4,64.11 10.4,21.19 17.33,14.26 90.18,14.26 93.93,18.01 93.93,49.59 v96.93,52.59
IO3  (via drill 0.35)
  Top 0.254: U3.15 v76.81,67.17 v76.8,67.16 | v38.18,77.86 v22.74,77.86 22.08,77.2 U5.1
  Bottom 0.254: v76.8,67.16 76.8,72.66 71.6,77.86 v38.18,77.86 | v22.74,77.86 22.07,77.19 P28.P$1
IO4_DOWN  (via drill 0.35)
  Top 0.254: R30.1 v11.46,40.53 9.22,40.53 K5.1 | v95.66,70.83 95.66,69.19 U3.4
  Bottom 0.254: v95.66,70.83 95.66,74.2 86.99,82.87 21.99,82.87 11.46,72.34 v11.46,40.53
IO5_CONF  (via drill 0.35)
  Top 0.254: R31.2 v12.42,44.49 9.22,44.49 K5.4 | U3.5 94.37,70.89 v94.36,70.86
  Bottom 0.254: v94.36,70.86 94.36,74.26 86.2,82.42 23.08,82.42 12.42,71.76 v12.42,44.49
IO6_UP  (via drill 0.35)
  Top 0.254: K5.2 9.21,46.5 v13.64,46.5 R29.1 | v93.15,70.79 93.15,69.22 U3.6
  Bottom 0.254: v93.15,70.79 93.15,74.34 85.53,81.96 24.46,81.96 13.64,71.14 v13.64,46.5
IO7_LCD_3.3_CTL  (via drill 0.35)
  Top 0.254: U3.7 91.83,68.38 91.48,68.03 67.83,68.03 64.36,64.56 v64.36,61.91 | v52.47,56.66 51.55,55.74 R172.1
  Bottom 0.254: v64.36,61.91 64.1,61.65 57.46,61.65 v52.47,56.66
IO8  (via drill 0.35)
  Top 0.254: v85.5,70.69 85.5,69.19 U3.12 | v33.86,79.09 22.77,79.09 20.5,76.82 20.5,72.24 v20.69,72.05 U5.20
  Bottom 0.254: v85.5,70.69 85.5,72.17 78.19,79.48 34.23,79.48 33.86,79.11 v33.86,79.09 | P20.P$1 20.72,72.05 v20.69,72.05
IO9  (via drill 0.35)
  Top 0.254: v46.51,64.63 43.23,61.35 28.12,61.35 25.47,64 v25.47,73.94 25.47,74.81 U5.2 | U3.17 v67.04,64.62
  Bottom 0.254: v67.04,64.62 67.02,64.64 47.43,64.64 47.42,64.63 v46.51,64.63 | P29.P$1 25.47,74.82 v25.47,73.94
IO10_SPI_CS  (via drill 0.35)
  Top 0.254: v55.64,60.99 55.83,61.18 68.89,61.18 71.08,63.37 78.42,63.37 U3.18 | R20.1 29.4,22.99 v29.4,21.55 v29.4,21.54 29.11,21.25 J1.2
  Bottom 0.254: v29.4,21.55 29.4,22.79 | 29.4,22.79 29.4,34.72 55.64,60.96 v55.64,60.99 | P8.P$1 29.43,22.76 29.4,22.79
IO11_SPI_MOSI  (via drill 0.35)
  Top 0.254: v86.16,62.08 U3.19 | U4.14 75.19,24.69 65.81,34.08 v65.73,34.08
  Bottom 0.254: v86.16,62.08 86.16,55.37 65.73,34.94 v65.73,34.08 67.46,32.35 P55.P$1
IO12_SPI_CLK  (via drill 0.35)
  Top 0.254: U4.13 75.69,23.65 75.7,23.66 75.7,25.06 65.68,35.08 v65.05,35.08 | U3.20 85.31,60.81 v85.35,60.77
  Bottom 0.254: v65.05,35.08 65.1,35.08 85.4,55.38 85.4,60.72 v85.35,60.77 | v65.05,35.08 | v65.05,35.08 P54.P$1
IO13_SPI_MISO  (via drill 0.35)
  Top 0.254: J1.7 v23.61,21.54 23.61,22.96 R22.1 | v50.24,60.08 50.46,60.08 50.46,60.07 80.15,60.07 80.68,59.54 U3.21
  Bottom 0.254: 23.62,22.8 23.62,33.45 v50.24,60.08 | 23.62,22.8 23.62,21.74 23.61,21.73 v23.61,21.54 | P11.P$1 23.6,22.78 23.62,22.8
IO14  (via drill 0.35)
  Top 0.254: v70.21,58.23 70.25,58.27 U3.22 | v47.7,63.98 46.94,63.98 43.76,60.8 27.57,60.8 24.62,63.75 v24.62,68.89 U5.19
  Bottom 0.254: v70.21,58.23 70.14,58.3 70.14,59.65 65.82,63.98 v47.7,63.98 | v24.62,68.89 v24.61,68.9 P21.P$1
IO15  (via drill 0.35)
  Top 0.254: U3.8 v90.56,70.75 v90.57,70.76 | U5.3 27.16,76.45 27.89,77.18 v27.92,77.18
  Bottom 0.254: v90.57,70.76 90.57,72.59 81.69,81.47 32.21,81.47 v27.92,77.18 27.15,76.41 P30.P$1
IO16  (via drill 0.35)
  Top 0.254: v89.26,70.72 89.26,69.18 U3.9 | U5.18 27.16,72.39 v27.19,72.42
  Bottom 0.254: v89.26,70.72 89.26,72.44 80.8,80.91 32.61,80.91 28.15,76.45 28.15,73.38 v27.19,72.42 27.17,72.4 P22.P$1
IO17  (via drill 0.35)
  Top 0.254: v88.03,70.74 88.02,70.72 U3.10 | v30.04,77.2 29.7,76.86 U5.4
  Bottom 0.254: v88.03,70.74 88.03,72.27 79.96,80.35 33.19,80.35 v30.04,77.2 29.71,76.87 P31.P$1
IO18  (via drill 0.35)
  Top 0.254: U3.11 86.78,69.2 v86.78,70.77 | v29.72,72.42 29.72,70.68 U5.17
  Bottom 0.254: v86.78,70.77 86.78,72.13 78.98,79.93 33.77,79.93 31.35,77.51 31.35,74.05 v29.72,72.42 29.69,72.39 P23.P$1
IO19  (via drill 0.35)
  Top 0.254: v84.22,70.69 U3.13 | v33.34,76.76 | U5.5 v33.34,76.76
  Bottom 0.254: v84.22,70.69 84.22,71.75 77.04,78.93 35.6,78.93 33.43,76.76 v33.34,76.76 32.28,75.7 P32.P$1
IO20  (via drill 0.35)
  Top 0.254: v82.93,70.7 U3.14 | v32.22,72.46 32.24,72.44 U5.16
  Bottom 0.254: v82.93,70.7 75.11,78.52 36.17,78.52 33.33,75.68 33.33,73.56 v32.22,72.46 | v32.22,72.46 | P24.P$1 32.22,70.64 v32.22,72.46
IO21  (via drill 0.35)
  Top 0.254: v42.89,63.28 36.57,63.28 35.78,64.07 v35.78,73.32 35.78,74.66 U5.6 | v69.49,57.16 78.28,57.16 U3.23
  Bottom 0.254: v42.89,63.28 65.61,63.28 69.49,59.39 v69.49,57.16 | P33.P$1 35.78,74.59 v35.78,73.32
IO38  (via drill 0.35)
  Top 0.254: v68.84,56.4 68.84,55.17 75.08,48.93 82.05,48.93 82.95,49.83 87.43,49.83 88.02,50.42 U3.31 | v41.79,62.61 36.03,62.61 34.72,63.92 v34.72,68.7 34.72,70.6 U5.15
  Bottom 0.254: v68.84,56.4 68.75,56.49 68.75,59.48 65.62,62.61 v41.79,62.61 | P25.P$1 34.75,68.73 v34.72,68.7
IO39_SPI_CLK  (via drill 0.35)
  Top 0.254: U3.32 89.29,50.54 88.08,49.33 83.02,49.33 82.22,48.53 74.92,48.53 63.84,59.6 51.11,59.6 v50.92,59.41 | v25.79,21.43 25.79,14.64 J1.5
  Bottom 0.254: v50.92,59.41 25.79,34.28 v25.79,21.43 24.59,20.23 P10.P$1
IO40_SPI_MOSI  (via drill 0.35)
  Top 0.254: U3.33 90.56,50.74 88.68,48.85 83.12,48.85 82.39,48.12 74.75,48.12 63.95,58.91 v51.7,58.91 v51.69,58.92 | v28,21.19 v28.01,21.18 | v28.01,21.18 J1.3 | R21.1 28.01,22.97 v28.01,21.18
  Bottom 0.254: v51.69,58.92 28,35.23 v28,21.19 28.98,20.21 P9.P$1
IO41_LED  (via drill 0.35)
  Top 0.254: v71.65,56.5 71.65,54.11 73.36,52.4 91.42,52.4 91.83,51.99 U3.34 | R16.1 54.16,82.86 54.06,82.76 v54.06,76.87
  Bottom 0.254: v71.65,56.5 71.65,56.53 71.52,56.66 71.52,72.08 66.73,76.87 v54.06,76.87
IO42_TF_3.3_CTL  (via drill 0.35)
  Top 0.254: v43.47,21.43 43.47,23.02 R15.1 | v95.98,52.61 95.28,53.31 93.69,53.31 93.1,52.72 U3.35
  Bottom 0.254: v43.47,21.43 49.54,15.36 89.95,15.36 93.53,18.94 93.53,50.13 95.98,52.59 v95.98,52.61
IO45_CS  (via drill 0.35)
  Top 0.254: U4.12 76.18,25.15 65.35,35.99 v64.88,35.99 | v82.86,53.77 82.26,53.17 U3.26
  Bottom 0.254: v82.86,53.77 65.08,35.99 v64.88,35.99 62.85,33.96 P53.P$1
IO46_D/C  (via drill 0.35)
  Top 0.254: U4.11 76.69,25.34 65.01,37.02 v64.71,37.02 | U3.16 83.86,65.89 v84.06,66.09
  Bottom 0.254: v84.06,66.09 84.15,66 84.15,56.02 65.15,37.02 v64.71,37.02 64.69,37.02 63.54,35.86 P52.P$1
IO47_RES  (via drill 0.35)
  Top 0.254: v64.83,38.16 64.83,37.85 77.19,25.49 U4.10 | v82.92,55.76 82.89,55.73 U3.24
  Bottom 0.254: v82.92,55.76 82.78,55.9 64.94,38.06 v64.83,38.16 v64.82,38.17 P51.P$1
IO48_BUSY  (via drill 0.35)
  Top 0.254: v79.79,54.44 79.77,54.46 U3.25 | U4.9 77.7,25.58 65.5,37.77 v65.5,39.61
  Bottom 0.254: v79.79,54.44 79.33,53.98 79.31,53.98 65.5,40.17 v65.5,39.61 64.93,40.18 P50.P$1
LCD_GND  (via drill 0.35)
  Top 0.254: U4.17 73.69,22.7 | U4.6 79.19,22.75 79.08,22.64 | 78.64,22.64 78.69,22.69 U4.7 78.69,22.74 78.65,22.7 78.19,22.7 U4.8 78.19,22.7 78.13,22.64 | C22.1 53.94,53.3
  Top 0.5: C22.1 52.56,53.36 Q9.3 52.47,48.63 52.47,48.62 | D5.C 62.46,45.35 C20.1 62.61,45.17 v62.61,43.94 | R18.1 56.01,42.43 R24.1 54.29,43.89 | 54.29,43.89 54.36,43.82 v54.36,46.74 52.47,48.62 | 54.29,43.89 C23.2 | C24.2 C25.2 C26.2 | C26.2 C27.2 C28.2 | v59.29,43.93 59.26,43.97 C29.1 v59.26,46.72 | C26.2 48.29,46.92 49.99,48.62 52.47,48.62 | 73.69,22.7 73.69,22.34 | 73.69,22.34 73.69,19.71 71.47,17.49 64.88,17.49 62.59,19.78 v62.59,41.28 | 73.69,22.34 v75.02,22.34 77.84,22.34 78.13,22.64 78.64,22.64 79.08,22.64 | 53.94,53.3 v53.94,51.52
  Bottom 0.254: P43.P$1 53.94,50.38
  Bottom 0.5: v59.29,43.93 v59.3,43.94 v62.61,43.94 62.59,43.92 v62.59,41.28 | v59.26,46.72 54.37,46.72 v54.36,46.74 | 53.94,50.38 v53.94,51.52 | P68.P$1 v75.02,22.34
N$1
  Top 0.254: Q1.1 85.59,37.29 87.79,37.29 R7.2
N$2
  Top 0.254: U1.2 82.15,35.09 R5.2
N$3
  Top 0.254: U1.3 82.37,33.82 R6.2
N$4
  Top 0.254: R8.2 88.28,40.67 Q2.1
N$5
  Top 0.254: J2.A5 94.18,21.76 R1.2
N$6
  Top 0.254: R11.1 R10.2 89.48,47.47 91.9,47.47 94.13,45.24 94.13,38.78 Q3.1
N$7
  Top 0.254: R172.2 50.43,54.21 Q9.1
N$8
  Top 0.254: R15.2 43.25,24.62 42.74,25.12 41.52,25.12 Q10.1
N$9
  Top 0.254: R13.1 68.97,39.31 R14.2 69,40.76 U2.5
N$10
  Top 0.254: J1.1 30.21,21.46 30.79,22.04 R19.1
N$11
  Top 0.7: U2.3 74.61,42.73 L1.1
  pour Top: 71.23,42.78 72.4,43.95 75.07,43.95 75.07,42.49 75.01,42.43 71.58,42.43
N$12
  Top 0.254: J2.B5 93.52,24.76 R4.1
N$13
  Top 0.254: C15.1 83.27,37.93 84.65,36.56 84.65,33.03 84.17,32.55 U1.4
N$16
  Top 0.254: U6.5 100.53,31.76 R12.2
N$20
  Top 0.254: J1.8 22.51,22.74 R23.1
N$25
  Top 0.254: R17.2 57.11,82.85 D1.+ R16.2
N$55
  Top 0.5: C21.1 63.36,53.37 63.36,53.36 | 63.36,53.36 62.46,52.46 D5.A | D4.C 64.27,52.45 63.36,53.36
N$56
  Top 0.8: 60.7,55.26 58.91,55.26 L2.2 Q4.3 | D6.A 60.7,55.26 | C21.2 60.7,55.26
  pour Top: 58.27,55.95 60.87,55.95 60.87,52.89 60.76,52.78 58.27,52.78
PREVGH  (via drill 0.35)
  Top 0.254: D6.C 60.7,45.28 C29.2 60.79,44.56 63.29,42.06 63.29,20.13 65.04,18.39 70.72,18.39 71.69,19.36 71.69,21.98 | 71.69,21.98 U4.21 | 71.69,21.98 72.54,21.98 v72.57,21.95
  Bottom 0.254: v72.57,21.95 72.57,20.31 P56.P$1
PREVGL  (via drill 0.35)
  Top 0.254: D4.A 64.16,47.28 C20.2 64.16,42.62 63.7,42.16 63.7,20.29 65.2,18.79 69.95,18.79 70.69,19.53 v70.69,21.8 U4.23
  Bottom 0.254: P57.P$1 v70.69,21.8
RESE  (via drill 0.35)
  Top 0.254: Q4.2 57.54,49.17 R24.2 58.13,43.89 59.98,42.05 59.98,34.02 v60.01,34.02 | v80.2,24.92 80.69,24.43 U4.3
  Bottom 0.254: v80.2,24.92 v80.2,24.93 79.74,25.39 75.47,25.39 73.01,27.85 66.08,27.85 60.01,33.92 v60.01,34.02 60.01,37.88 P67.P$1
RTS  (via drill 0.35)
  Top 0.254: U1.14 86.58,33.82 86.02,34.38 v86.02,34.86 | Q1.2 86.64,39.26 v86.7,39.31 88.11,39.31 R8.1
  Bottom 0.254: v86.7,39.31 86.02,38.64 v86.02,34.86
TF_GND  (via drill 0.35)
  Top 0.254: Q10.3 v40.55,21.9
  Top 0.5: J1.6 24.71,13.5 26.14,12.07 30.16,12.07 34.83,16.74 C17.1
  Top 0.8: Q10.3 40.52,23.08 C19.1 C18.1 C17.1
  Bottom 0.254: v40.55,21.9 P45.P$1
USB_D+  (via drill 0.35)
  Top 0.254: R3.2 91.7,23.62 89.1,23.62 | 89.1,23.62 88.71,23.62 85.8,26.53 85.8,29.02 83.54,31.28 U1.5 | 89.1,23.62 89.06,23.66 v89.06,24.27
  Bottom 0.254: v89.06,24.27 P4.P$1
USB_D-  (via drill 0.35)
  Top 0.254: R2.2 89.04,22.22 | 89.04,22.22 88.63,22.22 85.03,25.82 85.03,28.49 83.51,30.01 U1.6 | 89.04,22.22 v89.04,21.52 v89.03,21.51
  Bottom 0.254: v89.03,21.51 P3.P$1
VBUS  (via drill 0.35)
  Top 0.254: J2.B9 98.97,20.59 J2.A4 | 95.62,25.41 95.69,25.48 v95.69,26.95 | 98.97,25.49 J2.A9 98.82,25.41 | 98.97,25.49 98.9,25.42 | J2.B4 98.97,25.49
  Top 0.5: v77.61,28.16 77.61,28.21 76.21,29.61 76.21,31.21 | 93.5,26.42 94.51,25.41 95.62,25.41 98.82,25.41 | U1.16 90.02,36.36 C1.1 90.47,36.21 v91.82,34.85 | v91.79,32.96 91.84,33.01 98.27,33.01 U6.4 | R35.2 76.41,35.79 76.21,35.59 76.21,31.21 | R34.2 76.21,31.21 | 98.9,25.42 99.97,25.42 100.94,24.45 100.94,21.63 99.9,20.59 98.97,20.59
  Top 0.6: C4.2 91.38,30.29 v91.38,26.46
  Top 0.7: C3.2 91.35,31.9 C4.2 | 93.5,26.42 91.42,26.42 v91.38,26.46
  Top 0.8: v90.24,42.79 90.24,44.72 D2.1 88.8,45.26 R10.1 | v91.79,32.96 91.79,32.34 C3.2
  Bottom 0.254: v95.69,26.95 P2.P$1
  Bottom 0.5: v91.38,26.46 91.38,26.41 79.35,26.41 v77.61,28.16
  Bottom 0.8: v91.79,32.96 91.79,34.82 v91.82,34.85 91.82,41.21 v90.24,42.79
VCOM  (via drill 0.35)
  Top 0.254: v70.17,24.83 70.17,23.57 U4.24 | C28.1 45.5,42.41 54.03,33.87 v54.49,33.87
  Bottom 0.254: v70.17,24.83 v70.16,24.83 69.65,25.35 63.02,25.35 v54.49,33.87 52.44,33.87 P73.P$1
VDD  (via drill 0.35)
  Top 0.254: v73.18,24.74 U4.18 | C25.1 49.7,41.52 v57.25,33.98
  Bottom 0.254: v73.18,24.74 v73.18,24.73 73.18,25.47 72.09,26.57 64.65,26.57 v57.25,33.97 v57.25,33.98 53.37,37.85 P70.P$1
VDHR  (via drill 0.35)
  Top 0.254: C23.1 54.58,42.41 59.08,37.9 v59.08,33.99 | v79,24.74 79.46,24.74 79.69,24.5 U4.5
  Bottom 0.254: v79,24.74 v79,24.73 75.55,24.73 72.84,27.44 65.63,27.44 v59.08,33.99 59.08,36.25 P58.P$1
VIN
  Top 0.6: D2.2 92.77,48.27 83.89,48.27 82.87,47.25 70.19,47.25 C8.2 68.86,44.21 C7.2 68.9,42.76 U2.4 68.92,42.34 70.43,40.83 U2.1
  Top 0.8: D2.2 95.91,45.14 D3.C 95.52,41.29 Q3.2
VSH  (via drill 0.35)
  Top 0.254: v72.2,24.83 U4.20 | v56.32,33.98 48.29,42 C26.1
  Bottom 0.254: v72.2,24.83 72.2,25.45 71.5,26.16 64.14,26.16 v56.32,33.98 | v56.32,33.98 | v56.32,33.98 53.61,36.68 50.58,36.68 P71.P$1
VSL  (via drill 0.35)
  Top 0.254: U4.22 v71.19,24.8 | C27.1 47.44,41.85 47.45,41.85 55.33,33.97 v55.4,33.97
  Bottom 0.254: v71.19,24.8 v71.18,24.8 71.18,25.37 70.8,25.76 63.61,25.76 v55.4,33.97 54.81,34.55 P72.P$1

### Text on the board
tPlace: H2 | H1 | IO3 | IO9 | IO15 | IO17 | IO19 | IO21 | GND | GND | GND | GND | IO2 | IO8 | IO14 | IO16 | IO18 | IO20 | IO38 | 3V3 | 3V3 | 3V3 | 3V3 | IO7 | ESP32 Display-4.2(E) inch | SKU:DIE07300S | V1.0 | - | H5 | H6 | + | IO6 / IO5 / IO4 | IO1 | IO42 | IO10 => SPI_CS / IO40 => SPI_MOSI / IO39 => SPI_CLK / IO13 => SPI_MISO | E-paper | IO48 => LCD_BUSY / IO47 => LCD_RES / IO46 => LCD_D/C / IO45 => LCD_SPI_CS / IO12 => LCD_SPI_CLK / IO11 => LCD_SPI_MOSI | H3 | H4